# Altium schematic sheet PCB-Support-STM32F407.SchDoc: PCB Support STM32F407-Discovery
size Letter; ApprovedBy: kc; Organization: Cegep Limoilou; Address1: 1300, 8e Avenue; Address2: Québec, QC; Address3: Canada; Address4: G1J 5L5; SheetNumber: 1; SheetTotal: 11
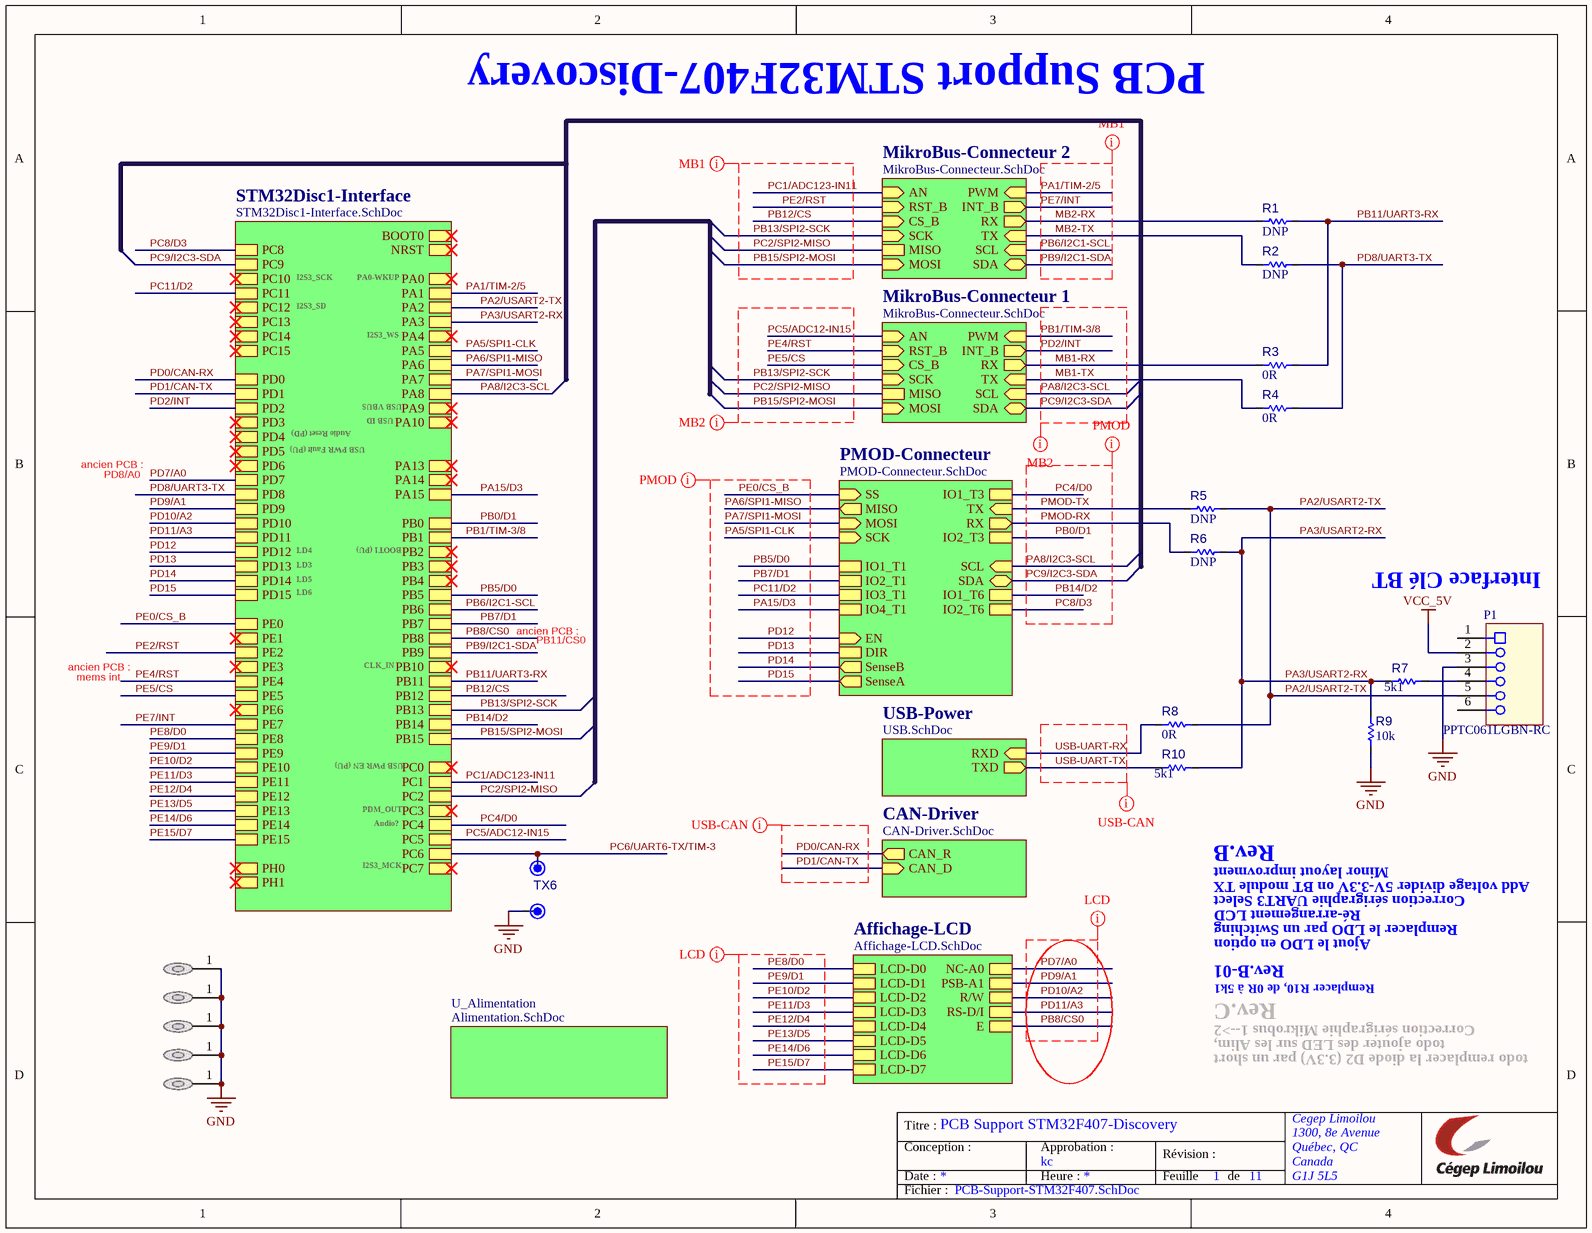
[diagram p0: PCB-Support-STM32F407.SchDoc]

## Parts
GND3  GND  [TP_TH061]  (value not drawn)  (no BOM)
MH1  DNP  [MP_M-Hole_#4-40_LOOSE-FIT]  (value not drawn)  (no BOM)
MH2  DNP  [MP_M-Hole_#4-40_LOOSE-FIT]  (value not drawn)  (no BOM)
MH3  DNP  [MP_M-Hole_#4-40_LOOSE-FIT]  (value not drawn)  (no BOM)
MH4  DNP  [MP_M-Hole_#4-40_LOOSE-FIT]  (value not drawn)  (no BOM)
MH5  DNP  [MP_M-Hole_#4-40_LOOSE-FIT]  (value not drawn)  (no BOM)
P1  PPTC061LGBN-RC  [P_CONN_HDR_1ROW_6POS_RA_100MIL]
R1  value DNP  [R_1005[0402]]  (hidden comment: Res 0R 0402)  (no BOM)
R2  value DNP  [R_1005[0402]]  (hidden comment: Res 0R 0402)  (no BOM)
R3  value 0R  [R_1005[0402]]  (hidden comment: Res 0R 0402)
R4  value 0R  [R_1005[0402]]  (hidden comment: Res 0R 0402)
R5  value DNP  [R_1005[0402]]  (hidden comment: Res 0R 0402)  (no BOM)
R6  value DNP  [R_1005[0402]]  (hidden comment: Res 0R 0402)  (no BOM)
R7  value 5k1  [R_1005[0402]]  (hidden comment: Res 5k1 1% 0402)
R8  value 0R  [R_1005[0402]]  (hidden comment: Res 0R 0402)
R9  value 10k  [R_1005[0402]]  (hidden comment: Res 10k 1% 0402)
R10  value 5k1  [R_1005[0402]]  (hidden comment: Res 5k1 1% 0402)
TX6  DNP  [TP_TH061]  (value not drawn)  (no BOM)

## Sub-sheets
Affichage-LCD = Affichage-LCD.SchDoc: LCD-D0, LCD-D1, LCD-D2, LCD-D3, LCD-D4, LCD-D5, LCD-D6, LCD-D7, NC-A0, PSB-A1, R/W, RS-D/I, E
CAN-Driver = CAN-Driver.SchDoc: CAN_D (in), CAN_R (out)
MikroBus-Connecteur 1 = MikroBus-Connecteur.SchDoc: AN (in), RST_B (in), CS_B (in), SCK (in), MISO, MOSI (in), PWM (in), INT_B (out), RX (out), TX (in), SCL (in), SDA (bidir)
MikroBus-Connecteur 2 = MikroBus-Connecteur.SchDoc: AN (in), RST_B (in), CS_B (in), SCK (in), MISO, MOSI (in), PWM (in), INT_B (out), RX (out), TX (in), SCL (in), SDA (bidir)
PMOD-Connecteur = PMOD-Connecteur.SchDoc: SS (in), MOSI (in), SCK (in), MISO (out), TX (in), RX (out), SCL (in), SDA (bidir), IO1_T3, IO2_T3, IO1_T6, IO2_T6, EN (in), SenseA (out), DIR, SenseB (out), IO1_T1, IO2_T1, IO3_T1, IO4_T1
STM32Disc1-Interface = STM32Disc1-Interface.SchDoc: BOOT0, NRST, PA0, PA1, PA2, PA3, PA4, PA5, PA6, PA7, PA8, PA9, PA10, PA13, PA14, PA15, PB0, PB1, PB2, PB3, PB4, PB5, PB6, PB7, PB8, PB9, PB10, PB11, PB12, PB13, PB14, PB15, PC0, PC1, PC2, PC3, PC4, PC5, PC6, PC7, PC8, PC9, PC10, PC11, PC12, PC13, PC14, PC15, PD0, PD1, PD2, PD3, PD4, PD5, PD6, PD7, PD8, PD9, PD10, PD11, PD12, PD13, PD14, PD15, PE0, PE1, PE2, PE3, PE4, PE5, PE6, PE7, PE8, PE9, PE10, PE11, PE12, PE13, PE14, PE15, PH0, PH1
U_Alimentation = Alimentation.SchDoc: no entries
USB-Power = USB.SchDoc: RXD (in), TXD (out)

## Nets
GND: GND3.1 MH1.1 MH2.1 MH3.1 MH4.1 MH5.1 P1.3 R9.1
VCC_5V: P1.2
MB1-RX: R3.1 ; sheet MikroBus-Connecteur 1/RX
MB1-TX: R4.1 ; sheet MikroBus-Connecteur 1/TX
MB2-RX: R1.1 ; sheet MikroBus-Connecteur 2/RX
MB2-TX: R2.1 ; sheet MikroBus-Connecteur 2/TX
PA1/TIM-2/5: sheet STM32Disc1-Interface/PA1, sheet MikroBus-Connecteur 2/PWM
PA2/USART2-TX: P1.5 R5.2 R8.2 ; sheet STM32Disc1-Interface/PA2
PA3/USART2-RX: R6.2 R7.1 R9.2 R10.2 ; sheet STM32Disc1-Interface/PA3
PA5/SPI1-CLK: sheet STM32Disc1-Interface/PA5, sheet PMOD-Connecteur/SCK
PA6/SPI1-MISO: sheet STM32Disc1-Interface/PA6, sheet PMOD-Connecteur/MISO
PA7/SPI1-MOSI: sheet STM32Disc1-Interface/PA7, sheet PMOD-Connecteur/MOSI
PA8/I2C3-SCL: sheet STM32Disc1-Interface/PA8, sheet MikroBus-Connecteur 1/SCL, sheet PMOD-Connecteur/SCL
PA15/D3: sheet STM32Disc1-Interface/PA15, sheet PMOD-Connecteur/IO4_T1
PB0/D1: sheet STM32Disc1-Interface/PB0, sheet PMOD-Connecteur/IO2_T3
PB1/TIM-3/8: sheet STM32Disc1-Interface/PB1, sheet MikroBus-Connecteur 1/PWM
PB5/D0: sheet STM32Disc1-Interface/PB5, sheet PMOD-Connecteur/IO1_T1
PB6/I2C1-SCL: sheet STM32Disc1-Interface/PB6, sheet MikroBus-Connecteur 2/SCL
PB7/D1: sheet STM32Disc1-Interface/PB7, sheet PMOD-Connecteur/IO2_T1
PB8/CS0: sheet STM32Disc1-Interface/PB8, sheet Affichage-LCD/E
PB9/I2C1-SDA: sheet STM32Disc1-Interface/PB9, sheet MikroBus-Connecteur 2/SDA
PB11/UART3-RX: R1.2 R3.2 ; sheet STM32Disc1-Interface/PB11
PB12/CS: sheet STM32Disc1-Interface/PB12, sheet MikroBus-Connecteur 2/CS_B
PB13/SPI2-SCK: sheet STM32Disc1-Interface/PB13, sheet MikroBus-Connecteur 2/SCK, sheet MikroBus-Connecteur 1/SCK
PB14/D2: sheet STM32Disc1-Interface/PB14, sheet PMOD-Connecteur/IO1_T6
PB15/SPI2-MOSI: sheet STM32Disc1-Interface/PB15, sheet MikroBus-Connecteur 2/MOSI, sheet MikroBus-Connecteur 1/MOSI
PC1/ADC123-IN11: sheet STM32Disc1-Interface/PC1, sheet MikroBus-Connecteur 2/AN
PC2/SPI2-MISO: sheet STM32Disc1-Interface/PC2, sheet MikroBus-Connecteur 2/MISO, sheet MikroBus-Connecteur 1/MISO
PC4/D0: sheet STM32Disc1-Interface/PC4, sheet PMOD-Connecteur/IO1_T3
PC5/ADC12-IN15: sheet STM32Disc1-Interface/PC5, sheet MikroBus-Connecteur 1/AN
PC6/UART6-TX/TIM-3: TX6.1 ; sheet STM32Disc1-Interface/PC6
PC8/D3: sheet STM32Disc1-Interface/PC8, sheet PMOD-Connecteur/IO2_T6
PC9/I2C3-SDA: sheet STM32Disc1-Interface/PC9, sheet MikroBus-Connecteur 1/SDA, sheet PMOD-Connecteur/SDA
PC11/D2: sheet STM32Disc1-Interface/PC11, sheet PMOD-Connecteur/IO3_T1
PD0/CAN-RX: sheet STM32Disc1-Interface/PD0, sheet CAN-Driver/CAN_R
PD1/CAN-TX: sheet STM32Disc1-Interface/PD1, sheet CAN-Driver/CAN_D
PD2/INT: sheet STM32Disc1-Interface/PD2, sheet MikroBus-Connecteur 1/INT_B
PD7/A0: sheet STM32Disc1-Interface/PD7, sheet Affichage-LCD/NC-A0
PD8/UART3-TX: R2.2 R4.2 ; sheet STM32Disc1-Interface/PD8
PD9/A1: sheet STM32Disc1-Interface/PD9, sheet Affichage-LCD/PSB-A1
PD10/A2: sheet STM32Disc1-Interface/PD10, sheet Affichage-LCD/R/W
PD11/A3: sheet STM32Disc1-Interface/PD11, sheet Affichage-LCD/RS-D/I
PD12: sheet STM32Disc1-Interface/PD12, sheet PMOD-Connecteur/EN
PD13: sheet STM32Disc1-Interface/PD13, sheet PMOD-Connecteur/DIR
PD14: sheet STM32Disc1-Interface/PD14, sheet PMOD-Connecteur/SenseB
PD15: sheet STM32Disc1-Interface/PD15, sheet PMOD-Connecteur/SenseA
PE0/CS_B: sheet STM32Disc1-Interface/PE0, sheet PMOD-Connecteur/SS
PE2/RST: sheet STM32Disc1-Interface/PE2, sheet MikroBus-Connecteur 2/RST_B
PE4/RST: sheet STM32Disc1-Interface/PE4, sheet MikroBus-Connecteur 1/RST_B
PE5/CS: sheet STM32Disc1-Interface/PE5, sheet MikroBus-Connecteur 1/CS_B
PE7/INT: sheet STM32Disc1-Interface/PE7, sheet MikroBus-Connecteur 2/INT_B
PE8/D0: sheet STM32Disc1-Interface/PE8, sheet Affichage-LCD/LCD-D0
PE9/D1: sheet STM32Disc1-Interface/PE9, sheet Affichage-LCD/LCD-D1
PE10/D2: sheet STM32Disc1-Interface/PE10, sheet Affichage-LCD/LCD-D2
PE11/D3: sheet STM32Disc1-Interface/PE11, sheet Affichage-LCD/LCD-D3
PE12/D4: sheet STM32Disc1-Interface/PE12, sheet Affichage-LCD/LCD-D4
PE13/D5: sheet STM32Disc1-Interface/PE13, sheet Affichage-LCD/LCD-D5
PE14/D6: sheet STM32Disc1-Interface/PE14, sheet Affichage-LCD/LCD-D6
PE15/D7: sheet STM32Disc1-Interface/PE15, sheet Affichage-LCD/LCD-D7
PMOD-RX: R6.1 ; sheet PMOD-Connecteur/RX
PMOD-TX: R5.1 ; sheet PMOD-Connecteur/TX
USB-UART-RX: R8.1 ; sheet USB-Power/RXD
USB-UART-TX: R10.1 ; sheet USB-Power/TXD
NetP1_4: P1.4 R7.2

Not connected (* = marked no-connect by the designer): P1 1 6

## Layout directives
net class USB-CAN: PD0/CAN-RX, PD1/CAN-TX, USB-UART-RX, USB-UART-TX
net class LCD: PB8/CS0, PD7/A0, PD9/A1, PD10/A2, PD11/A3, PE8/D0, PE9/D1, PE10/D2, PE11/D3, PE12/D4, PE13/D5, PE14/D6, PE15/D7
net class PMOD: PA5/SPI1-CLK, PA6/SPI1-MISO, PA7/SPI1-MOSI, PA8/I2C3-SCL, PA15/D3, PB0/D1, PB5/D0, PB7/D1, PB14/D2, PC4/D0, PC8/D3, PC9/I2C3-SDA, PC11/D2, PD12, PD13, PD14, PD15, PE0/CS_B, PMOD-RX, PMOD-TX
net class MB2: MB1-RX, MB1-TX, PA8/I2C3-SCL, PB1/TIM-3/8, PB13/SPI2-SCK, PB15/SPI2-MOSI, PC2/SPI2-MISO, PC5/ADC12-IN15, PC9/I2C3-SDA, PD2/INT, PE4/RST, PE5/CS
net class MB1: MB2-RX, MB2-TX, PA1/TIM-2/5, PB6/I2C1-SCL, PB9/I2C1-SDA, PB12/CS, PB13/SPI2-SCK, PB15/SPI2-MOSI, PC1/ADC123-IN11, PC2/SPI2-MISO, PE2/RST, PE7/INT

## Notes on the sheet
- I2S3_SCK
- I2S3_SD
- PA0-WKUP
- I2S3_WS
- PD8/A0
- ancien PCB :
- USB PWR Fault (PU)
- Audio Reset (PD)
- USB VBUS
- USB ID
- LD3
- LD4
- LD5
- LD6
- BOOT1 (PU)
- (near P1) Interface Clé BT
- mems int
- CLK_IN
- PB11/CS0
- USB PWR EN (PU)
- PDM_OUT
- Audio?
- I2S3_MCK
- Rev.B
- Minor layout improvment
- Add voltage divider 5V-3.3V on BT module TX
- Correction sérigraphie UART3 Select
- Ré-arrangement LCD
- Remplacer le LDO par un Switching
- Ajout le LDO en option
- Rev.C
- Correction sérigraphie Mikrobus 1-->2
- Rev.B-01
- Remplacer R10, de 0R à 5k1
- todo ajouter des LED sur les Alim,
- todo remplacer la diode D2 (3.3V) par un short
- Titre :
- Conception :
- Date :
- Approbation :
- Heure :
- Révision :
- Feuille
- de
- Fichier :

## Library data of the parts
GND3 = TP_TH0.61mm(AWG28): Pad TH 0.61mm diameter (AWG28); Value: DNP; Manufacturer Part Number 1: DNP; Supplier Part Number 1: N/A; Supplier 1: N/A
MH1-MH5 = MH-4-40: Mounting Hole #4-40 w/ Flat Washer; Manufacturer Part Number 1: DNP; Value: DNP; Supplier Part Number 1: N/A
P1 = CONN-100MIL-SKT-01X06_RA: CONN SOCKET 6pos 100mils Right Angle; Manufacturer 1: Megastar; Manufacturer Part Number 1: ZX-PM2.54-1-6PWZ; Mounting Technology: TH; Manufacturer 2: Sullins; Manufacturer Part Number 2: PPTC061LGBN-RC; Supplier 1: LCSC; Supplier Part Number 1: C49326178; Manufacturer 3: Samtec; Manufacturer Part Number 3: SSW-106-02-T-S-RA; Supplier 2: Digikey; Supplier Part Number 2: S5442-ND
R1-R6 R8 = RES005: Resistor type 1; Manufacturer 1: Yageo; Manufacturer Part Number 1: RC0402JR-070RL; LibRef: RES005; Max Working Voltage: 50V; Mounting Technology: SMT; Supplier 1: LCSC; Supplier Part Number 1: C60485
R7 R10 = RES010: Resistor type 1; Manufacturer 1: Panasonic; Manufacturer Part Number 1: ERJ-2RKF5101X; LibRef: RES010; Puissance: 1/16W; Max Working Voltage: 50V; Tolerance: 1%; Mounting Technology: SMT; Supplier 1: LCSC; Supplier Part Number 1: C25905
R9 = RES003: Resistor type 1; Manufacturer 1: Vishay; Manufacturer Part Number 1: CR0402F1002T1LF; LibRef: RES003; Puissance: 1/16W; Max Working Voltage: 50V; Tolerance: 1%; Mounting Technology: SMT; Supplier 1: Digikey; Supplier Part Number 1: 541-10.0KLCT-ND
TX6 = TP_TH0.61mm(AWG28): Pad TH 0.61mm diameter (AWG28); Value: DNP; Manufacturer Part Number 1: DNP; Supplier Part Number 1: N/A; Supplier 1: N/A